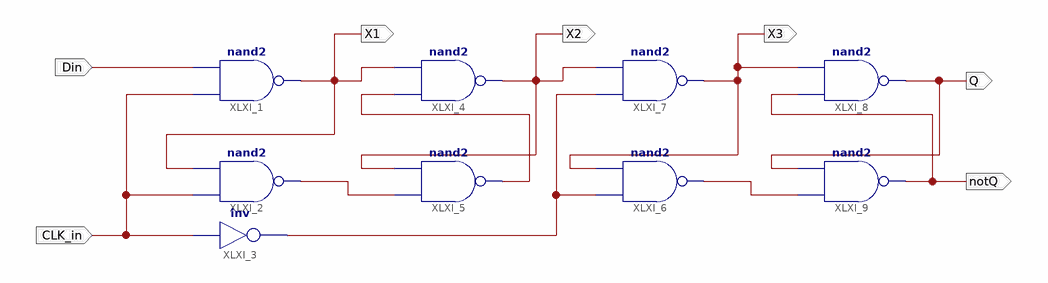
[diagram p0: schematic sheet 1]
// Xilinx ISE schematic Lab7_Ex5.sch (spartan3e) as structural Verilog: 9 symbols, 7 ports
module Lab7_Ex5 (
  input  Din,
  input  CLK_in,
  output X1,
  output X2,
  output X3,
  output Q,
  output notQ
);

  wire XLXN_5, XLXN_6, XLXN_8, XLXN_11;

  nand XLXI_1 (X1, CLK_in, Din);
  nand XLXI_2 (XLXN_5, CLK_in, X1);
  not XLXI_3 (XLXN_8, CLK_in);
  nand XLXI_4 (X2, XLXN_6, X1);
  nand XLXI_5 (XLXN_6, XLXN_5, X2);
  nand XLXI_6 (XLXN_11, XLXN_8, X3);
  nand XLXI_7 (X3, XLXN_8, X2);
  nand XLXI_8 (Q, notQ, X3);
  nand XLXI_9 (notQ, XLXN_11, Q);
endmodule
